# Altium schematic sheet MCU.SchDoc
size A4
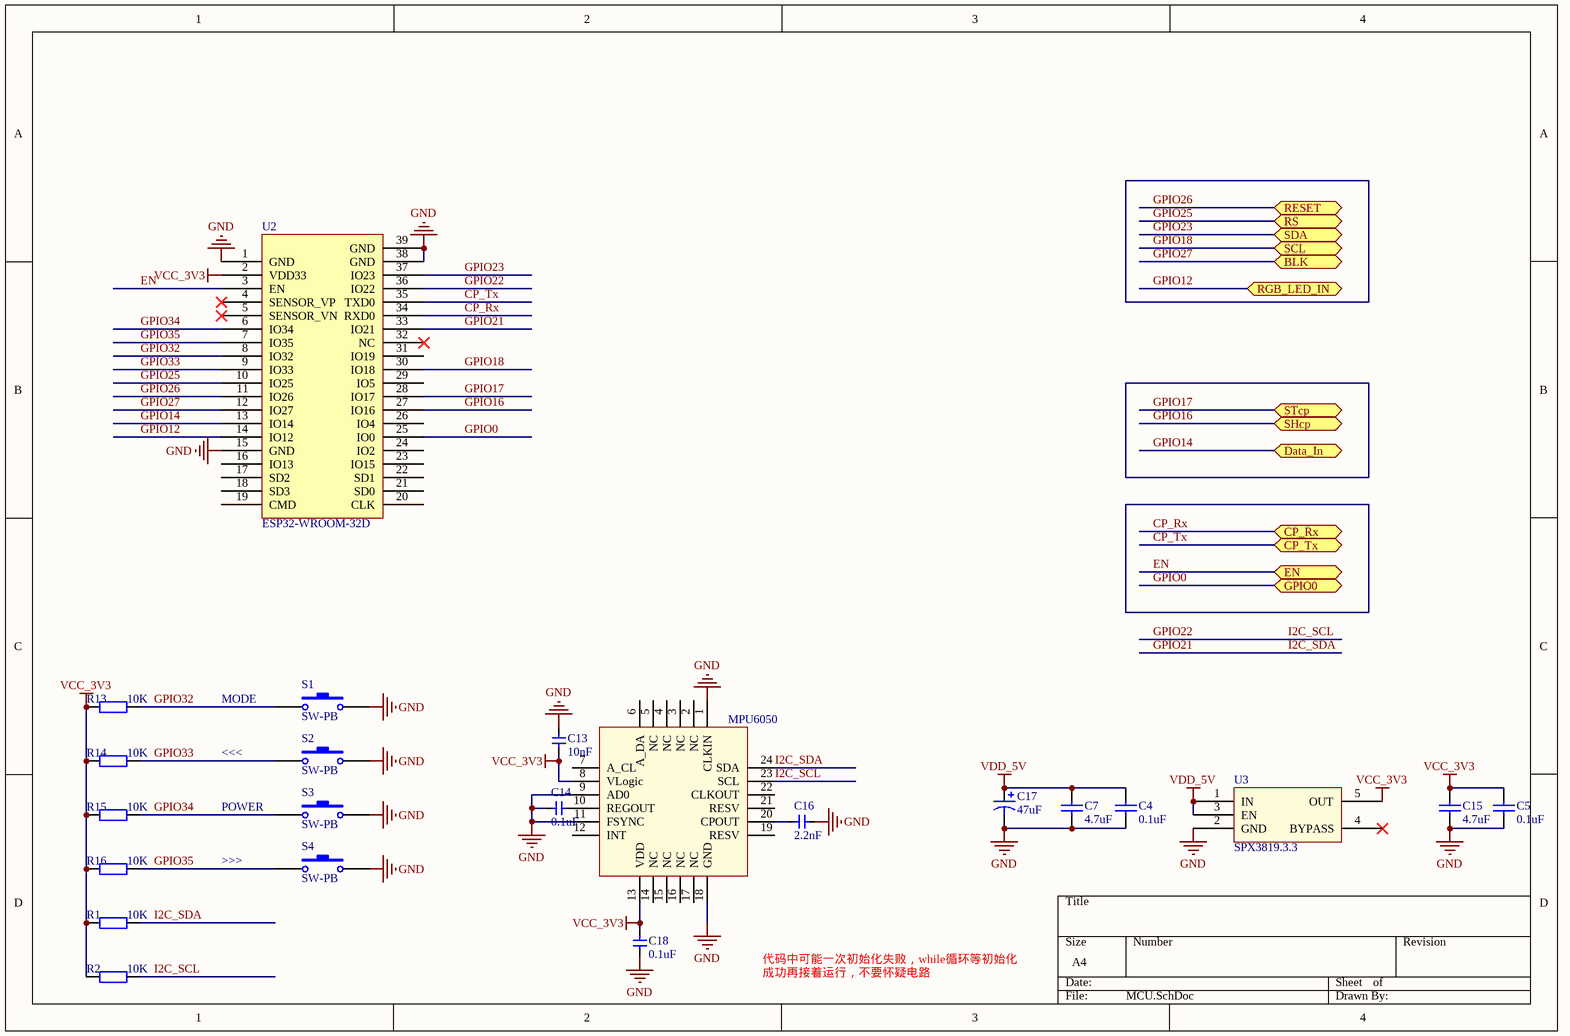
[diagram p0: MCU.SchDoc]

## Parts
C4  0.1uF  [C0603]
C5  0.1uF  [C0603]
C7  4.7uF  [C0603]
C13  10nF  [C0603]
C14  0.1uF  [C0603]
C15  4.7uF  [C0603]
C16  2.2nF  [C0603]
C17  47uF  [6032-C/P]
C18  0.1uF  [C0603]
R1  10K  [R0603]
R2  10K  [R0603]
R13  10K  [R0603]
R14  10K  [R0603]
R15  10K  [R0603]
R16  10K  [R0603]
S1  SW-PB  [6*6*6]
S2  SW-PB  [6*6*6]
S3  SW-PB  [6*6*6]
S4  SW-PB  [6*6*6]
U2  ESP32-WROOM-32D  [ESP32-WROOM-32D]
U3  SPX3819.3.3  [SOT23-5]
U6  MPU6050  [QFN-24]

## Ports
BLK, CP_Rx, CP_Tx, Data_In, EN, GPIO0, RESET, RGB_LED_IN, RS, SCL, SDA, SHcp, STcp

## Nets
GND: C4.2 C5.2 C7.2 C13.2 C14.2 C15.2 C16.1 C17.2 C18.1 S1.2 S2.2 S3.2 S4.2 U2.1(GND) U2.15(GND) U2.38(GND) U2.39(GND) U3.2(GND) U6.1(CLKIN) U6.9(AD0) U6.11(FSYNC) U6.18(GND)
VCC_3V3: C5.1 C13.1 C15.1 C18.2 R1.1 R2.1 R13.1 R14.1 R15.1 R16.1 U2.2(VDD33) U3.5(OUT) U6.8(VLogic) U6.13(VDD)
VDD_5V: C4.1 C7.1 C17.1 U3.1(IN) U3.3(EN)
CP_Rx: U2.34(RXD0) ; port CP_Rx
CP_Tx: U2.35(TXD0) ; port CP_Tx
EN: U2.3(EN) ; port EN
GPIO0: U2.25(IO0) ; port GPIO0
GPIO12: U2.14(IO12) ; port RGB_LED_IN
GPIO14: U2.13(IO14) ; port Data_In
GPIO16: U2.27(IO16) ; port SHcp
GPIO17: U2.28(IO17) ; port STcp
GPIO18: U2.30(IO18) ; port SCL
GPIO21: R1.2 U2.33(IO21) U6.24(SDA)  [also labelled I2C_SDA]
GPIO22: R2.2 U2.36(IO22) U6.23(SCL)  [also labelled I2C_SCL]
GPIO23: U2.37(IO23) ; port SDA
GPIO25: U2.10(IO25) ; port RS
GPIO26: U2.11(IO26) ; port RESET
GPIO27: U2.12(IO27) ; port BLK
GPIO32: R13.2 S1.1 U2.8(IO32)
GPIO33: R14.2 S2.1 U2.9(IO33)
GPIO34: R15.2 S3.1 U2.6(IO34)
GPIO35: R16.2 S4.1 U2.7(IO35)
NetC14_1: C14.1 U6.10(REGOUT)
NetC16_2: C16.2 U6.20(CPOUT)

Not connected (* = marked no-connect by the designer): U2 4(SENSOR_VP)* 5(SENSOR_VN)* 16(IO13) 17(SD2) 18(SD3) 19(CMD) 20(CLK) 21(SD0) 22(SD1) 23(IO15) 24(IO2) 26(IO4) 29(IO5) 31(IO19) 32(NC)*; U3 4(BYPASS)*; U6 2(NC) 3(NC) 4(NC) 5(NC) 6(A_DA) 7(A_CL) 12(INT) 14(NC) 15(NC) 16(NC) 17(NC) 19(RESV) 21(RESV) 22(CLKOUT)

## Notes on the sheet
- MODE
- <<<
- POWER
- >>>
- 代码中可能一次初始化失败，while循环等初始化成功再接着运行，不要怀疑电路

## Library data of the parts
C4 C5 C7 C15 = Cap: Capacitor; Value: 1.0uF/50V; Published: 8-Jun-2000; LatestRevisionDate: 17-Jul-2002; LatestRevisionNote: Re-released for DXP Platform.; PackageReference: RAD-0.3; Publisher: Altium Limited; PackageDescription: Radial Cap, Thru-Hole; 2 Leads; 0.3 in Pin Spacing
C13 C14 C16 C18 = 电容-0402: Capacitor; Value: 0.1u
C17 = Cap Pol1: Polarized Capacitor (Radial); Value: 100pF; Published: 8-Jun-2000; LatestRevisionDate: 17-Jul-2002; LatestRevisionNote: Re-released for DXP Platform.; PackageReference: RB7.6-15; Publisher: Altium Limited; PackageDescription: Polarized Capacitor (Radial); 2 Leads
R1 R2 R13-R16 = Res: 电阻; Value: 1K; Published: 8-Jun-2000; LatestRevisionDate: 17-Jul-2002; LatestRevisionNote: Re-released for DXP Platform.; PackageReference: R0603; Publisher: Altium Limited
S1-S4 = SW-PB: Switch; Published: 24-Mar-1999; LatestRevisionDate: 17-Jul-2002; LatestRevisionNote: Re-released for DXP Platform.; PackageReference: SPST-2; Publisher: Altium Limited; PackageDescription: Switch; 2 Leads
U3 = SPX3819.3.3: LDO
U6 = MPU6050: 六轴传感器